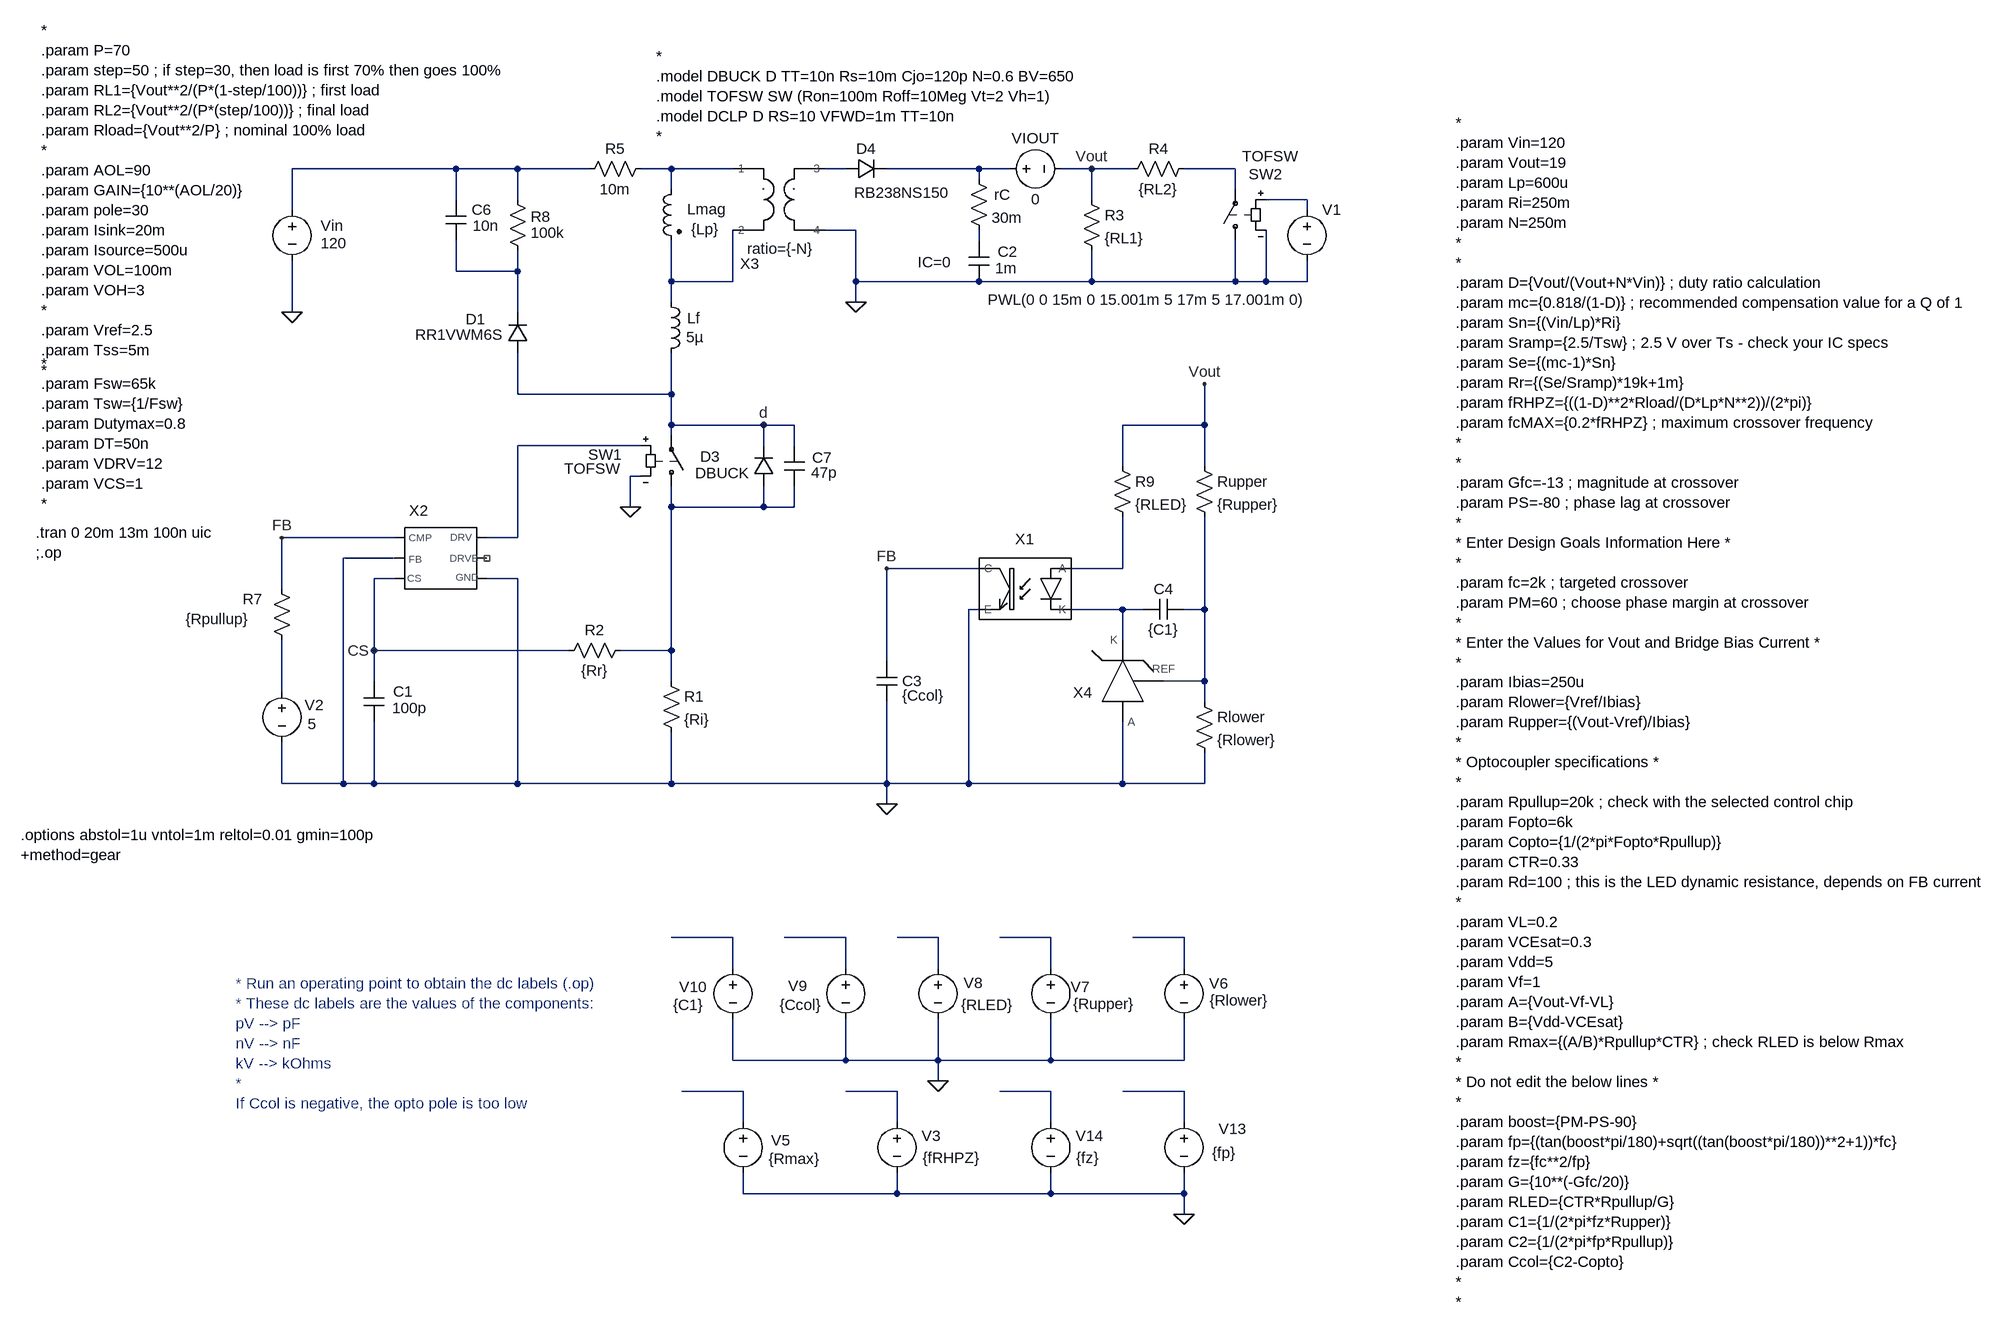
[diagram p0: schematic Flyback CM - isolated - cbc - load step.asc]
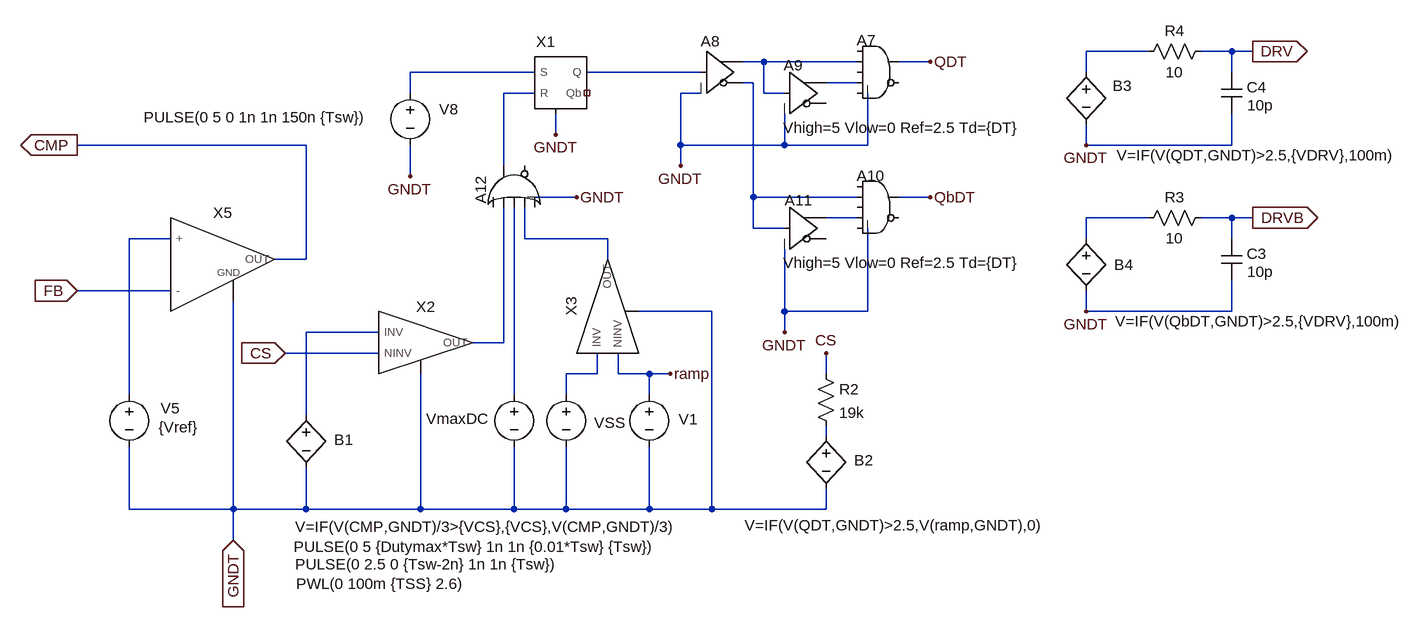
[diagram p1: sub-circuit generic_cm_pwm.asc]
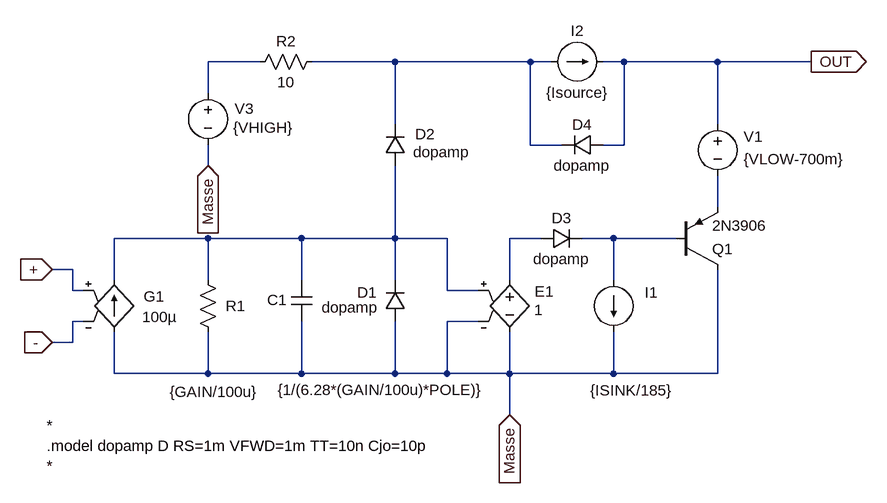
[diagram p2: sub-circuit op_amp_fan_out.asc]
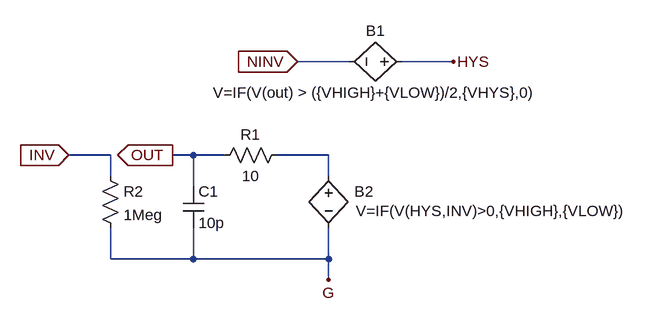
[diagram p3: sub-circuit comptof_g.asc]
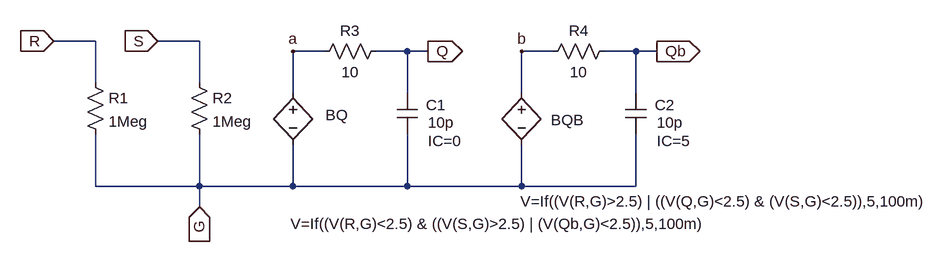
[diagram p4: sub-circuit sr_latch_g.asc]
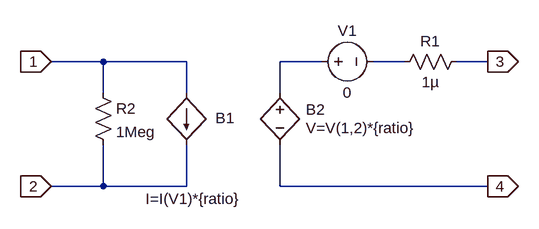
[diagram p5: sub-circuit xfmr.asc]
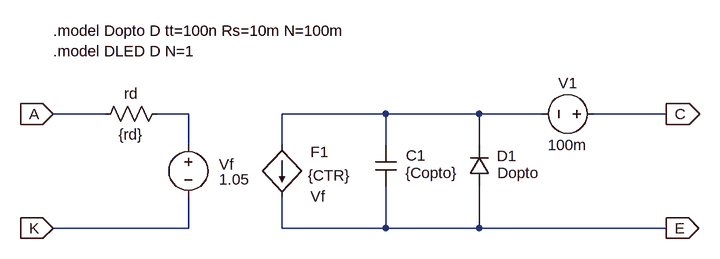
[diagram p6: sub-circuit optotof.asc]
Flyback CM - isolated - cbc - load step.asc, the LTspice schematic file:
Version 4.1
SHEET 1 3452 1760
WIRE -160 -224 -416 -224
WIRE -64 -224 -160 -224
WIRE 48 -224 -64 -224
WIRE 176 -224 128 -224
WIRE 272 -224 176 -224
WIRE 448 -224 416 -224
WIRE 656 -224 512 -224
WIRE 704 -224 656 -224
WIRE 832 -224 784 -224
WIRE 896 -224 832 -224
WIRE 1056 -224 976 -224
WIRE 656 -208 656 -224
WIRE 176 -192 176 -224
WIRE 1056 -192 1056 -224
WIRE -160 -176 -160 -224
WIRE -64 -176 -64 -224
WIRE 832 -176 832 -224
WIRE 1168 -176 1104 -176
WIRE -416 -160 -416 -224
WIRE 1168 -160 1168 -176
WIRE 464 -128 416 -128
WIRE 656 -112 656 -128
WIRE -160 -64 -160 -112
WIRE -64 -64 -64 -96
WIRE -64 -64 -160 -64
WIRE 176 -48 176 -112
WIRE 272 -48 272 -128
WIRE 272 -48 176 -48
WIRE 464 -48 464 -128
WIRE 656 -48 464 -48
WIRE 832 -48 832 -96
WIRE 832 -48 656 -48
WIRE 1056 -48 1056 -112
WIRE 1056 -48 832 -48
WIRE 1104 -48 1104 -128
WIRE 1104 -48 1056 -48
WIRE 1168 -48 1168 -80
WIRE 1168 -48 1104 -48
WIRE 176 -16 176 -48
WIRE 464 -16 464 -48
WIRE -416 0 -416 -80
WIRE -64 0 -64 -64
WIRE -64 128 -64 64
WIRE 176 128 176 64
WIRE 176 128 -64 128
WIRE 176 176 176 128
WIRE 320 176 176 176
WIRE 368 176 320 176
WIRE 1008 176 1008 112
WIRE 1008 176 880 176
WIRE 176 192 176 176
WIRE 128 208 -64 208
WIRE 320 208 320 176
WIRE 368 208 368 176
WIRE 880 240 880 176
WIRE 1008 240 1008 176
WIRE 128 256 112 256
WIRE 112 304 112 256
WIRE 176 304 176 272
WIRE 320 304 320 272
WIRE 320 304 176 304
WIRE 368 304 368 272
WIRE 368 304 320 304
WIRE -256 352 -432 352
WIRE -64 352 -64 208
WIRE -64 352 -112 352
WIRE -256 384 -336 384
WIRE 656 400 512 400
WIRE 880 400 880 320
WIRE 880 400 800 400
WIRE -256 416 -288 416
WIRE -64 416 -112 416
WIRE -432 432 -432 352
WIRE 656 464 640 464
WIRE 880 464 800 464
WIRE 912 464 880 464
WIRE 1008 464 1008 320
WIRE 1008 464 976 464
WIRE 880 512 880 464
WIRE -288 528 -288 416
WIRE 16 528 -288 528
WIRE 176 528 176 304
WIRE 176 528 96 528
WIRE 512 544 512 400
WIRE -288 576 -288 528
WIRE 176 576 176 528
WIRE 1008 576 1008 464
WIRE 1008 576 944 576
WIRE -432 592 -432 512
WIRE 1008 608 1008 576
WIRE -432 736 -432 672
WIRE -336 736 -336 384
WIRE -336 736 -432 736
WIRE -288 736 -288 640
WIRE -288 736 -336 736
WIRE -64 736 -64 416
WIRE -64 736 -288 736
WIRE 176 736 176 656
WIRE 176 736 -64 736
WIRE 512 736 512 608
WIRE 512 736 176 736
WIRE 640 736 640 464
WIRE 640 736 512 736
WIRE 880 736 880 640
WIRE 880 736 640 736
WIRE 1008 736 1008 688
WIRE 1008 736 880 736
WIRE 512 768 512 736
WIRE 272 976 176 976
WIRE 448 976 352 976
WIRE 592 976 528 976
WIRE 768 976 688 976
WIRE 976 976 896 976
WIRE 272 1024 272 976
WIRE 448 1024 448 976
WIRE 592 1024 592 976
WIRE 768 1024 768 976
WIRE 976 1024 976 976
WIRE 272 1168 272 1104
WIRE 448 1168 448 1104
WIRE 448 1168 272 1168
WIRE 592 1168 592 1104
WIRE 592 1168 448 1168
WIRE 768 1168 768 1104
WIRE 768 1168 592 1168
WIRE 976 1168 976 1104
WIRE 976 1168 768 1168
WIRE 592 1200 592 1168
WIRE 288 1216 192 1216
WIRE 528 1216 448 1216
WIRE 768 1216 688 1216
WIRE 976 1216 880 1216
WIRE 288 1264 288 1216
WIRE 528 1264 528 1216
WIRE 768 1264 768 1216
WIRE 976 1264 976 1216
WIRE 288 1376 288 1344
WIRE 528 1376 528 1344
WIRE 528 1376 288 1376
WIRE 768 1376 768 1344
WIRE 768 1376 528 1376
WIRE 976 1376 976 1344
WIRE 976 1376 768 1376
WIRE 976 1408 976 1376
FLAG 464 -16 0
FLAG -416 0 0
FLAG 832 -224 Vout
FLAG 512 768 0
FLAG 1008 112 Vout
FLAG 592 1200 0
FLAG 976 1408 0
FLAG 320 176 d
FLAG 512 400 FB
FLAG -432 352 FB
FLAG 112 304 0
FLAG -288 528 CS
DATAFLAG 192 976 ""
DATAFLAG 384 976 ""
DATAFLAG 560 976 ""
DATAFLAG 704 976 ""
DATAFLAG 928 976 ""
DATAFLAG 896 1216 ""
DATAFLAG 736 1216 ""
DATAFLAG 496 1216 ""
DATAFLAG 208 1216 ""
SYMBOL ind2 192 -208 M0
WINDOW 0 -69 47 Left 2
WINDOW 3 -58 78 Left 2
SYMATTR InstName Lmag
SYMATTR Value {Lp}
SYMATTR Type ind
SYMBOL sw 176 288 M180
WINDOW 3 -80 44 Right 2
WINDOW 0 -78 66 Right 2
SYMATTR Value TOFSW
SYMATTR InstName SW1
SYMBOL res 640 -224 R0
WINDOW 0 40 40 Left 2
SYMATTR InstName rC
SYMATTR Value 30m
SYMBOL cap 640 -112 R0
WINDOW 0 45 17 Left 2
WINDOW 3 41 43 Left 2
WINDOW 123 -80 34 Left 2
SYMATTR InstName C2
SYMATTR Value 1m
SYMATTR Value2 IC=0
SYMBOL res 816 -192 R0
SYMATTR InstName R3
SYMATTR Value {RL1}
SYMBOL voltage -416 -176 R0
WINDOW 0 45 41 Left 2
WINDOW 3 45 68 Left 2
SYMATTR InstName Vin
SYMATTR Value 120
SYMBOL res 992 592 R0
SYMATTR InstName Rlower
SYMATTR Value {Rlower}
SYMBOL res 992 224 R0
SYMATTR InstName Rupper
SYMATTR Value {Rupper}
SYMBOL voltage 976 1008 R0
WINDOW 0 39 40 Left 2
WINDOW 3 40 66 Left 2
WINDOW 123 0 0 Left 0
WINDOW 39 0 0 Left 0
SYMATTR InstName V6
SYMATTR Value {Rlower}
SYMBOL voltage 768 1008 R0
WINDOW 0 31 45 Left 2
WINDOW 3 35 72 Left 2
WINDOW 123 0 0 Left 0
WINDOW 39 0 0 Left 0
SYMATTR InstName V7
SYMATTR Value {Rupper}
SYMBOL voltage 592 1008 R0
WINDOW 0 40 39 Left 2
WINDOW 3 36 73 Left 2
WINDOW 123 0 0 Left 0
WINDOW 39 0 0 Left 0
SYMATTR InstName V8
SYMATTR Value {RLED}
SYMBOL voltage 448 1008 R0
WINDOW 0 -90 44 Left 2
WINDOW 3 -103 73 Left 2
SYMATTR InstName V9
SYMATTR Value {Ccol}
SYMBOL voltage 272 1008 R0
WINDOW 0 -84 45 Left 2
WINDOW 3 -93 73 Left 2
WINDOW 123 0 0 Left 0
WINDOW 39 0 0 Left 0
SYMATTR InstName V10
SYMATTR Value {C1}
SYMBOL voltage 976 1248 R0
WINDOW 0 54 27 Left 2
WINDOW 3 44 64 Left 2
WINDOW 123 0 0 Left 0
WINDOW 39 0 0 Left 0
SYMATTR InstName V13
SYMATTR Value {fp}
SYMBOL voltage 768 1248 R0
WINDOW 0 39 38 Left 2
WINDOW 3 40 72 Left 2
SYMATTR InstName V14
SYMATTR Value {fz}
SYMBOL res 144 -240 R90
WINDOW 0 0 56 VBottom 2
WINDOW 3 32 56 VTop 2
SYMATTR InstName R5
SYMATTR Value 10m
SYMBOL voltage 528 1248 R0
WINDOW 0 39 38 Left 2
WINDOW 3 40 72 Left 2
SYMATTR InstName V3
SYMATTR Value {fRHPZ}
SYMBOL ind 160 -32 R0
WINDOW 0 41 41 Left 2
WINDOW 3 39 71 Left 2
SYMATTR InstName Lf
SYMATTR Value 5µ
SYMBOL diode -48 64 R180
WINDOW 0 66 53 Left 2
WINDOW 3 40 29 Left 2
SYMATTR InstName D1
SYMATTR Value RR1VWM6S
SYMBOL res -80 -192 R0
WINDOW 0 36 43 Left 2
WINDOW 3 36 68 Left 2
SYMATTR InstName R8
SYMATTR Value 100k
SYMBOL cap -176 -176 R0
WINDOW 0 40 16 Left 2
WINDOW 3 42 41 Left 2
SYMATTR InstName C6
SYMATTR Value 10n
SYMBOL diode 336 272 R180
WINDOW 0 84 47 Left 2
WINDOW 3 40 21 Left 2
SYMATTR InstName D3
SYMATTR Value DBUCK
SYMBOL cap 352 208 R0
WINDOW 0 44 19 Left 2
WINDOW 3 42 42 Left 2
SYMATTR InstName C7
SYMATTR Value 47p
SYMBOL voltage -432 576 R0
WINDOW 0 36 37 Left 2
WINDOW 3 40 67 Left 2
SYMATTR InstName V2
SYMATTR Value 5
SYMBOL res -448 416 R0
WINDOW 3 -134 63 Left 2
WINDOW 0 -45 32 Left 2
SYMATTR Value {Rpullup}
SYMATTR InstName R7
SYMBOL cap 496 544 R0
WINDOW 0 40 32 Left 2
WINDOW 3 40 54 Left 2
SYMATTR InstName C3
SYMATTR Value {Ccol}
SYMBOL res 864 224 R0
SYMATTR InstName R9
SYMATTR Value {RLED}
SYMBOL cap 976 448 R90
WINDOW 0 0 32 VBottom 2
WINDOW 3 32 32 VTop 2
SYMATTR InstName C4
SYMATTR Value {C1}
SYMBOL voltage 288 1248 R0
WINDOW 0 44 45 Left 2
WINDOW 3 40 74 Left 2
WINDOW 123 0 0 Left 0
WINDOW 39 0 0 Left 0
SYMATTR InstName V5
SYMATTR Value {Rmax}
SYMBOL diode 448 -208 R270
WINDOW 0 32 32 VTop 2
WINDOW 3 -6 87 VBottom 2
SYMATTR InstName D4
SYMATTR Value RB238NS150
SYMBOL res 160 560 R0
SYMATTR InstName R1
SYMATTR Value {Ri}
SYMBOL res 112 512 R90
WINDOW 0 0 56 VBottom 2
WINDOW 3 32 56 VTop 2
SYMATTR InstName R2
SYMATTR Value {Rr}
SYMBOL cap -304 576 R0
WINDOW 0 46 16 Left 2
WINDOW 3 44 42 Left 2
SYMATTR InstName C1
SYMATTR Value 100p
SYMBOL res 992 -240 R90
WINDOW 0 0 56 VBottom 2
WINDOW 3 32 56 VTop 2
SYMATTR InstName R4
SYMATTR Value {RL2}
SYMBOL sw 1056 -96 R180
WINDOW 3 -98 148 Left 2
WINDOW 0 -73 120 Left 2
SYMATTR Value TOFSW
SYMATTR InstName SW2
SYMBOL voltage 1168 -176 R0
WINDOW 3 -498 156 Left 2
WINDOW 123 0 0 Left 0
WINDOW 39 0 0 Left 0
SYMATTR Value PWL(0 0 15m 0 15.001m 5 17m 5 17.001m 0)
SYMATTR InstName V1
SYMBOL voltage 688 -224 R270
WINDOW 0 32 56 VTop 2
WINDOW 3 -32 56 VBottom 2
SYMATTR InstName VIOUT
SYMATTR Value 0
SYMBOL TOF\\Subcircuits\\Generic_CM_PWM -192 352 R0
WINDOW 0 -27 -27 Bottom 2
SYMATTR InstName X2
SYMATTR SpiceLine gain={gain} pole={pole} Isink={Isink} Isource={Isource} Vlow={VOL} Vhigh={VOH}
SYMBOL TOF\\Subcircuits\\XFMR 304 -208 R0
WINDOW 0 -6 148 Bottom 2
WINDOW 39 42 124 Bottom 2
SYMATTR InstName X3
SYMATTR SpiceLine ratio={-N}
SYMBOL TOF\\Subcircuits\\optoTOF 688 432 M0
SYMATTR InstName X1
SYMATTR SpiceLine Copto={Copto} Rd={Rd} CTR={CTR}
SYMBOL TOF\\Subcircuits\\TL431TOF 864 528 R0
WINDOW 0 -46 81 Bottom 2
SYMATTR InstName X4
TEXT 152 -400 Left 2 !*\n.model DBUCK D TT=10n Rs=10m Cjo=120p N=0.6 BV=650\n.model TOFSW SW (Ron=100m Roff=10Meg Vt=2 Vh=1)\n.model DCLP D RS=10 VFWD=1m TT=10n\n*
TEXT -816 344 Left 2 !.tran 0 20m 13m 100n uic\n;.op
TEXT -840 816 Left 2 !.options abstol=1u vntol=1m reltol=0.01 gmin=100p\n+method=gear
TEXT -504 1048 Left 2 ;* Run an operating point to obtain the dc labels (.op)\n* These dc labels are the values of the components:\npV --> pF\nnV --> nF\nkV --> kOhms\n*\nIf Ccol is negative, the opto pole is too low
TEXT 1400 -296 Left 2 !*\n.param Vin=120\n.param Vout=19\n.param Lp=600u\n.param Ri=250m\n.param N=250m\n*\n*\n.param D={Vout/(Vout+N*Vin)} ; duty ratio calculation\n.param mc={0.818/(1-D)} ; recommended compensation value for a Q of 1\n.param Sn={(Vin/Lp)*Ri}\n.param Sramp={2.5/Tsw} ; 2.5 V over Ts - check your IC specs\n.param Se={(mc-1)*Sn}\n.param Rr={(Se/Sramp)*19k+1m}\n.param fRHPZ={((1-D)**2*Rload/(D*Lp*N**2))/(2*pi)}\n.param fcMAX={0.2*fRHPZ} ; maximum crossover frequency\n*\n*\n.param Gfc=-13 ; magnitude at crossover\n.param PS=-80 ; phase lag at crossover\n*\n* Enter Design Goals Information Here *\n*\n.param fc=2k ; targeted crossover\n.param PM=60 ; choose phase margin at crossover\n*\n* Enter the Values for Vout and Bridge Bias Current *\n*\n.param Ibias=250u\n.param Rlower={Vref/Ibias}\n.param Rupper={(Vout-Vref)/Ibias}\n*\n* Optocoupler specifications *\n*\n.param Rpullup=20k ; check with the selected control chip\n.param Fopto=6k\n.param Copto={1/(2*pi*Fopto*Rpullup)}\n.param CTR=0.33\n.param Rd=100 ; this is the LED dynamic resistance, depends on FB current\n*\n.param VL=0.2\n.param VCEsat=0.3\n.param Vdd=5\n.param Vf=1\n.param A={Vout-Vf-VL}\n.param B={Vdd-VCEsat}\n.param Rmax={(A/B)*Rpullup*CTR} ; check RLED is below Rmax\n*\n* Do not edit the below lines *\n*\n.param boost={PM-PS-90}\n.param fp={(tan(boost*pi/180)+sqrt((tan(boost*pi/180))**2+1))*fc}\n.param fz={fc**2/fp}\n.param G={10**(-Gfc/20)}\n.param RLED={CTR*Rpullup/G}\n.param C1={1/(2*pi*fz*Rupper)}\n.param C2={1/(2*pi*fp*Rpullup)}\n.param Ccol={C2-Copto}\n*\n*
TEXT -808 -440 Left 2 !*\n.param P=70\n.param step=50 ; if step=30, then load is first 70% then goes 100%\n.param RL1={Vout**2/(P*(1-step/100))} ; first load\n.param RL2={Vout**2/(P*(step/100))} ; final load\n.param Rload={Vout**2/P} ; nominal 100% load\n*\n.param AOL=90\n.param GAIN={10**(AOL/20)}\n.param pole=30\n.param Isink=20m\n.param Isource=500u\n.param VOL=100m\n.param VOH=3\n*\n.param Vref=2.5\n.param Tss=5m\n*
TEXT -808 80 Left 2 !*\n.param Fsw=65k\n.param Tsw={1/Fsw}\n.param Dutymax=0.8\n.param DT=50n\n.param VDRV=12\n.param VCS=1\n*

generic_cm_pwm.asc, the sub-circuit schematic file:
Version 4.1
SHEET 1 1744 1720
WIRE 448 816 352 816
WIRE 576 816 528 816
WIRE 608 816 576 816
WIRE -144 832 -176 832
WIRE 0 832 -144 832
WIRE 112 832 64 832
WIRE -496 848 -688 848
WIRE -240 848 -416 848
WIRE 352 848 352 816
WIRE 576 848 576 816
WIRE -160 864 -176 864
WIRE 0 864 -48 864
WIRE -688 880 -688 848
WIRE -496 880 -544 880
WIRE -240 880 -272 880
WIRE -144 880 -144 832
WIRE -112 880 -144 880
WIRE -464 944 -464 912
WIRE -848 960 -1200 960
WIRE -272 960 -272 880
WIRE -112 960 -112 912
WIRE -112 960 -272 960
WIRE 16 960 16 880
WIRE 16 960 -112 960
WIRE 352 960 352 928
WIRE 576 960 576 912
WIRE 576 960 352 960
WIRE -544 992 -544 880
WIRE -272 992 -272 960
WIRE -688 1008 -688 960
WIRE -432 1040 -496 1040
WIRE -160 1040 -160 864
WIRE 0 1040 -160 1040
WIRE 112 1040 64 1040
WIRE 0 1072 -48 1072
WIRE 448 1072 352 1072
WIRE 576 1072 528 1072
WIRE 608 1072 576 1072
WIRE -160 1088 -160 1040
WIRE -112 1088 -160 1088
WIRE -1056 1104 -1120 1104
WIRE -512 1104 -512 1056
WIRE -384 1104 -512 1104
WIRE 352 1104 352 1072
WIRE 576 1104 576 1072
WIRE -848 1136 -848 960
WIRE -848 1136 -896 1136
WIRE -384 1136 -384 1104
WIRE -1056 1184 -1200 1184
WIRE -224 1216 -336 1216
WIRE -112 1216 -112 1120
WIRE 16 1216 16 1088
WIRE 16 1216 -112 1216
WIRE 352 1216 352 1184
WIRE 576 1216 576 1168
WIRE 576 1216 352 1216
WIRE -736 1248 -848 1248
WIRE -112 1248 -112 1216
WIRE -544 1264 -544 1056
WIRE -544 1264 -592 1264
WIRE -736 1280 -880 1280
WIRE -400 1312 -400 1280
WIRE -400 1312 -448 1312
WIRE -368 1312 -368 1280
WIRE -320 1312 -368 1312
WIRE -288 1312 -320 1312
WIRE -48 1312 -48 1280
WIRE -1120 1344 -1120 1104
WIRE -528 1344 -528 1056
WIRE -448 1344 -448 1312
WIRE -320 1344 -320 1312
WIRE -848 1376 -848 1248
WIRE -48 1408 -48 1392
WIRE -1120 1520 -1120 1424
WIRE -960 1520 -960 1200
WIRE -960 1520 -1120 1520
WIRE -848 1520 -848 1456
WIRE -848 1520 -960 1520
WIRE -672 1520 -672 1312
WIRE -672 1520 -848 1520
WIRE -528 1520 -528 1424
WIRE -528 1520 -672 1520
WIRE -448 1520 -448 1424
WIRE -448 1520 -528 1520
WIRE -320 1520 -320 1424
WIRE -320 1520 -448 1520
WIRE -224 1520 -224 1216
WIRE -224 1520 -320 1520
WIRE -48 1520 -48 1488
WIRE -48 1520 -224 1520
WIRE -960 1568 -960 1520
FLAG 112 832 QDT
FLAG 112 1040 QbDT
FLAG 352 1216 GNDT
FLAG 352 960 GNDT
FLAG 608 1072 DRVB
IOPIN 608 1072 Out
FLAG 608 816 DRV
IOPIN 608 816 Out
FLAG -1200 960 CMP
IOPIN -1200 960 Out
FLAG -1200 1184 FB
IOPIN -1200 1184 In
FLAG -880 1280 CS
IOPIN -880 1280 In
FLAG -960 1568 GNDT
IOPIN -960 1568 In
FLAG -688 1008 GNDT
FLAG -112 1248 GNDT
FLAG -272 992 GNDT
FLAG -464 944 GNDT
FLAG -432 1040 GNDT
FLAG -288 1312 ramp
FLAG -48 1280 CS
SYMBOL Digital\\and 32 784 R0
WINDOW 0 -33 15 Left 2
SYMATTR InstName A7
SYMATTR SpiceLine Vhigh=5 Vlow=0 Ref=2.5
SYMBOL Digital\\buf -240 784 R0
WINDOW 0 -1 16 Left 2
SYMATTR InstName A8
SYMATTR SpiceLine Vhigh=5 Vlow=0 Ref=1.0
SYMBOL Digital\\buf -112 816 R0
WINDOW 0 -1 21 Left 2
WINDOW 39 -2 117 Left 2
SYMATTR InstName A9
SYMATTR SpiceLine Vhigh=5 Vlow=0 Ref=2.5 Td={DT}
SYMBOL Digital\\and 32 992 R0
WINDOW 0 -33 15 Left 2
SYMATTR InstName A10
SYMATTR SpiceLine Vhigh=5 Vlow=0 Ref=2.5
SYMBOL Digital\\buf -112 1024 R0
WINDOW 0 0 21 Left 2
WINDOW 39 -2 117 Left 2
SYMATTR InstName A11
SYMATTR SpiceLine Vhigh=5 Vlow=0 Ref=2.5 Td={DT}
SYMBOL bv 352 832 R0
WINDOW 0 41 37 Left 2
WINDOW 3 47 144 Left 2
SYMATTR InstName B3
SYMATTR Value V=IF(V(QDT,GNDT)>2.5,{VDRV},100m)
SYMBOL bv 352 1088 R0
WINDOW 0 43 56 Left 2
WINDOW 3 45 143 Left 2
SYMATTR InstName B4
SYMATTR Value V=IF(V(QbDT,GNDT)>2.5,{VDRV},100m)
SYMBOL res 544 1056 R90
WINDOW 0 0 56 VBottom 2
WINDOW 3 32 56 VTop 2
SYMATTR InstName R3
SYMATTR Value 10
SYMBOL cap 560 1104 R0
WINDOW 0 39 23 Left 2
WINDOW 3 40 51 Left 2
SYMATTR InstName C3
SYMATTR Value 10p
SYMBOL res 544 800 R90
WINDOW 0 0 56 VBottom 2
WINDOW 3 32 56 VTop 2
SYMATTR InstName R4
SYMATTR Value 10
SYMBOL cap 560 848 R0
WINDOW 0 39 23 Left 2
WINDOW 3 40 51 Left 2
SYMATTR InstName C4
SYMATTR Value 10p
SYMBOL op_amp_fan_out -976 1136 R0
SYMATTR InstName X5
SYMATTR SpiceLine gain={gain} pole={pole} Isink={Isink} Isource={Isource} Vlow={VOL} Vhigh={VOH}
SYMBOL Digital\\or -592 1024 R270
WINDOW 0 -27 13 Left 2
SYMATTR InstName A12
SYMATTR SpiceLine Vhigh=5 Vlow=0 Ref=2.5
SYMBOL voltage -1120 1328 R0
WINDOW 0 48 37 Left 2
WINDOW 3 45 66 Left 2
SYMATTR InstName V5
SYMATTR Value {Vref}
SYMBOL voltage -688 864 R0
WINDOW 0 45 41 Left 2
WINDOW 3 -410 53 Left 2
WINDOW 123 0 0 Left 0
WINDOW 39 0 0 Left 0
SYMATTR InstName V8
SYMATTR Value PULSE(0 5 0 1n 1n 150n {Tsw})
SYMBOL voltage -528 1328 R0
WINDOW 0 -135 53 Left 2
WINDOW 3 -339 250 Left 2
WINDOW 123 0 0 Left 0
WINDOW 39 0 0 Left 0
SYMATTR InstName VmaxDC
SYMATTR Value PULSE(0 5 {Dutymax*Tsw} 1n 1n {0.01*Tsw} {Tsw})
SYMBOL bv -848 1360 R0
WINDOW 0 43 53 Left 2
WINDOW 3 -17 187 Left 2
SYMATTR InstName B1
SYMATTR Value V=IF(V(CMP,GNDT)/3>{VCS},{VCS},V(CMP,GNDT)/3)
SYMBOL voltage -320 1328 R0
WINDOW 0 45 54 Left 2
WINDOW 3 -545 277 Left 2
WINDOW 123 0 0 Left 0
WINDOW 39 0 0 Left 0
SYMATTR InstName V1
SYMATTR Value PULSE(0 2.5 0 {Tsw-2n} 1n 1n {Tsw})
SYMBOL voltage -448 1328 R0
WINDOW 0 43 59 Left 2
WINDOW 3 -415 307 Left 2
WINDOW 123 0 0 Left 0
WINDOW 39 0 0 Left 0
SYMATTR InstName VSS
SYMATTR Value PWL(0 100m {TSS} 2.6)
SYMBOL res -64 1296 R0
SYMATTR InstName R2
SYMATTR Value 19k
SYMBOL bv -48 1392 R0
WINDOW 0 43 53 Left 2
WINDOW 3 -125 153 Left 2
SYMATTR InstName B2
SYMATTR Value V=IF(V(QDT,GNDT)>2.5,V(ramp,GNDT),0)
SYMBOL TOF\\Subcircuits\\COMPTOF_G -672 1264 R0
SYMATTR InstName X2
SYMATTR SpiceLine VHIGH=5 VLOW=100m VHYS=10m
SYMBOL TOF\\Subcircuits\\COMPTOF_G -384 1216 R270
SYMATTR InstName X3
SYMATTR SpiceLine VHIGH=5 VLOW=100m VHYS=10m
SYMBOL TOF\\Subcircuits\\SR_latch_G -464 864 R0
WINDOW 0 -15 -47 Bottom 2
SYMATTR InstName X1

op_amp_fan_out.asc, the sub-circuit schematic file:
Version 4.1
SHEET 1 1504 680
WIRE 96 -224 16 -224
WIRE 304 -224 176 -224
WIRE 512 -224 304 -224
WIRE 544 -224 512 -224
WIRE 656 -224 624 -224
WIRE 800 -224 656 -224
WIRE 944 -224 800 -224
WIRE 16 -176 16 -224
WIRE 304 -128 304 -224
WIRE 800 -128 800 -224
WIRE 512 -96 512 -224
WIRE 560 -96 512 -96
WIRE 656 -96 656 -224
WIRE 656 -96 624 -96
WIRE 16 -64 16 -96
WIRE 800 0 800 -48
WIRE 16 48 -128 48
WIRE 160 48 16 48
WIRE 304 48 304 -64
WIRE 304 48 160 48
WIRE 384 48 304 48
WIRE 528 48 480 48
WIRE 640 48 592 48
WIRE 736 48 640 48
WIRE -192 96 -224 96
WIRE -128 112 -128 48
WIRE 16 112 16 48
WIRE 160 112 160 48
WIRE 304 112 304 48
WIRE 480 112 480 48
WIRE 640 112 640 48
WIRE -192 128 -192 96
WIRE -176 128 -192 128
WIRE 384 128 384 48
WIRE 432 128 384 128
WIRE -176 176 -192 176
WIRE 432 176 384 176
WIRE -192 208 -192 176
WIRE -192 208 -224 208
WIRE -128 256 -128 192
WIRE 16 256 16 192
WIRE 16 256 -128 256
WIRE 160 256 160 176
WIRE 160 256 16 256
WIRE 304 256 304 176
WIRE 304 256 160 256
WIRE 384 256 384 176
WIRE 384 256 304 256
WIRE 480 256 480 192
WIRE 480 256 384 256
WIRE 640 256 640 192
WIRE 640 256 480 256
WIRE 800 256 800 96
WIRE 800 256 640 256
WIRE 480 320 480 256
FLAG -224 96 +
IOPIN -224 96 In
FLAG -224 208 -
IOPIN -224 208 In
FLAG 944 -224 OUT
IOPIN 944 -224 Out
FLAG 480 320 Masse
IOPIN 480 320 In
FLAG 16 -64 Masse
IOPIN 16 -64 In
DATAFLAG 800 -16 ""
SYMBOL g -128 96 R0
WINDOW 0 45 41 Left 2
WINDOW 3 43 73 Left 2
SYMATTR InstName G1
SYMATTR Value 100µ
SYMBOL res 0 96 R0
WINDOW 0 43 56 Left 2
WINDOW 3 -43 188 Left 2
SYMATTR InstName R1
SYMATTR Value {GAIN/100u}
SYMBOL cap 144 112 R0
WINDOW 0 -37 31 Left 2
WINDOW 3 -21 169 Left 2
SYMATTR InstName C1
SYMATTR Value {1/(6.28*(GAIN/100u)*POLE)}
SYMBOL diode 320 176 R180
WINDOW 0 44 45 Left 2
WINDOW 3 41 22 Left 2
SYMATTR InstName D1
SYMATTR Value dopamp
SYMBOL e 480 96 R0
WINDOW 0 39 34 Left 2
WINDOW 3 38 62 Left 2
SYMATTR InstName E1
SYMATTR Value 1
SYMBOL diode 528 64 R270
WINDOW 0 32 32 VTop 2
WINDOW 3 0 32 VBottom 2
SYMATTR InstName D3
SYMATTR Value dopamp
SYMBOL current 640 112 R0
WINDOW 0 48 19 Left 2
WINDOW 3 -36 170 Left 2
SYMATTR InstName I1
SYMATTR Value {ISINK/185}
SYMBOL pnp 736 96 M180
SYMATTR InstName Q1
SYMATTR Value 2N3906
SYMBOL voltage 800 -144 R0
WINDOW 0 40 35 Left 2
WINDOW 3 40 70 Left 2
SYMATTR InstName V1
SYMATTR Value {VLOW-700m}
SYMBOL current 544 -224 R270
WINDOW 0 32 40 VTop 2
WINDOW 3 -32 40 VBottom 2
SYMATTR InstName I2
SYMATTR Value {Isource}
SYMBOL diode 624 -80 M270
WINDOW 0 32 32 VTop 2
WINDOW 3 0 32 VBottom 2
SYMATTR InstName D4
SYMATTR Value dopamp
SYMBOL voltage 16 -192 R0
WINDOW 0 41 40 Left 2
WINDOW 3 39 69 Left 2
SYMATTR InstName V3
SYMATTR Value {VHIGH}
SYMBOL diode 288 -64 M180
WINDOW 0 47 49 Left 2
WINDOW 3 44 21 Left 2
SYMATTR InstName D2
SYMATTR Value dopamp
SYMBOL res 192 -240 R90
WINDOW 0 0 56 VBottom 2
WINDOW 3 32 56 VTop 2
SYMATTR InstName R2
SYMATTR Value 10
TEXT -232 336 Left 2 !*\n.model dopamp D RS=1m VFWD=1m TT=10n Cjo=10p\n*

comptof_g.asc, the sub-circuit schematic file:
Version 4.1
SHEET 1 880 680
WIRE 64 192 -16 192
WIRE 224 192 144 192
WIRE -304 336 -368 336
WIRE -176 336 -208 336
WIRE -128 336 -176 336
WIRE 32 336 -48 336
WIRE -304 368 -304 336
WIRE 32 368 32 336
WIRE -176 384 -176 336
WIRE -304 496 -304 448
WIRE -176 496 -176 448
WIRE -176 496 -304 496
WIRE 32 496 32 448
WIRE 32 496 -176 496
WIRE 32 528 32 496
FLAG -16 192 NINV
IOPIN -16 192 In
FLAG 224 192 HYS
FLAG -208 336 OUT
IOPIN -208 336 Out
FLAG -368 336 INV
IOPIN -368 336 In
FLAG 32 528 G
SYMBOL bv 160 192 R90
WINDOW 0 -32 56 VBottom 2
WINDOW 3 32 56 VTop 2
SYMATTR InstName B1
SYMATTR Value V=IF(V(out) > ({VHIGH}+{VLOW})/2,{VHYS},0)
SYMBOL bv 32 352 R0
WINDOW 0 40 40 Left 2
WINDOW 3 42 70 Left 2
SYMATTR InstName B2
SYMATTR Value V=IF(V(HYS,INV)>0,{VHIGH},{VLOW})
SYMBOL res -32 320 R90
WINDOW 0 0 56 VBottom 2
WINDOW 3 32 56 VTop 2
SYMATTR InstName R1
SYMATTR Value 10
SYMBOL cap -192 384 R0
SYMATTR InstName C1
SYMATTR Value 10p
SYMBOL res -320 352 R0
SYMATTR InstName R2
SYMATTR Value 1Meg

sr_latch_g.asc, the sub-circuit schematic file:
Version 4.1
SHEET 1 1168 680
WIRE -192 48 -256 48
WIRE -32 48 -96 48
WIRE 160 64 112 64
WIRE 288 64 240 64
WIRE 320 64 288 64
WIRE 512 64 464 64
WIRE 640 64 592 64
WIRE 672 64 640 64
WIRE -192 112 -192 48
WIRE -32 112 -32 48
WIRE 112 128 112 64
WIRE 288 128 288 64
WIRE 464 128 464 64
WIRE 640 128 640 64
WIRE -192 272 -192 192
WIRE -32 272 -32 192
WIRE -32 272 -192 272
WIRE 112 272 112 208
WIRE 112 272 -32 272
WIRE 288 272 288 192
WIRE 288 272 112 272
WIRE 464 272 464 208
WIRE 464 272 288 272
WIRE 640 272 640 192
WIRE 640 272 464 272
WIRE -32 304 -32 272
FLAG -256 48 R
IOPIN -256 48 In
FLAG -96 48 S
IOPIN -96 48 In
FLAG 320 64 Q
IOPIN 320 64 Out
FLAG 672 64 Qb
IOPIN 672 64 Out
FLAG 112 64 a
FLAG 464 64 b
FLAG -32 304 G
IOPIN -32 304 In
SYMBOL bv 112 112 R0
WINDOW 0 50 50 Left 2
WINDOW 3 -4 218 Left 2
SYMATTR InstName BQ
SYMATTR Value V=If((V(R,G)<2.5) & ((V(S,G)>2.5) | (V(Qb,G)<2.5)),5,100m)
SYMBOL res -208 96 R0
SYMATTR InstName R1
SYMATTR Value 1Meg
SYMBOL res -48 96 R0
SYMATTR InstName R2
SYMATTR Value 1Meg
SYMBOL res 256 48 R90
WINDOW 0 0 56 VBottom 2
WINDOW 3 32 56 VTop 2
SYMATTR InstName R3
SYMATTR Value 10
SYMBOL cap 272 128 R0
WINDOW 0 45 19 Left 2
WINDOW 3 48 46 Left 2
WINDOW 123 48 74 Left 2
SYMATTR InstName C1
SYMATTR Value 10p
SYMATTR Value2 IC=0
SYMBOL bv 464 112 R0
WINDOW 0 45 58 Left 2
WINDOW 3 -2 183 Left 2
SYMATTR InstName BQB
SYMATTR Value V=If((V(R,G)>2.5) | ((V(Q,G)<2.5) & (V(S,G)<2.5)),5,100m)
SYMBOL res 608 48 R90
WINDOW 0 0 56 VBottom 2
WINDOW 3 32 56 VTop 2
SYMATTR InstName R4
SYMATTR Value 10
SYMBOL cap 624 128 R0
WINDOW 0 45 19 Left 2
WINDOW 3 48 46 Left 2
WINDOW 123 48 74 Left 2
SYMATTR InstName C2
SYMATTR Value 10p
SYMATTR Value2 IC=5

xfmr.asc, the sub-circuit schematic file:
Version 4.1
SHEET 1 880 680
WIRE 32 96 -48 96
WIRE 160 96 32 96
WIRE 368 96 304 96
WIRE 496 96 448 96
WIRE 624 96 576 96
WIRE 32 144 32 96
WIRE 160 144 160 96
WIRE 304 144 304 96
WIRE 32 288 32 224
WIRE 32 288 -48 288
WIRE 160 288 160 224
WIRE 160 288 32 288
WIRE 304 288 304 224
WIRE 624 288 304 288
FLAG 624 288 4
IOPIN 624 288 Out
FLAG 624 96 3
IOPIN 624 96 Out
FLAG -48 96 1
IOPIN -48 96 In
FLAG -48 288 2
IOPIN -48 288 In
SYMBOL bi 160 144 R0
WINDOW 0 45 39 Left 2
WINDOW 3 -63 163 Left 2
SYMATTR InstName B1
SYMATTR Value I=I(V1)*{ratio}
SYMBOL bv 304 128 R0
WINDOW 0 40 42 Left 2
WINDOW 3 40 70 Left 2
SYMATTR InstName B2
SYMATTR Value V=V(1,2)*{ratio}
SYMBOL voltage 352 96 R270
WINDOW 0 32 56 VTop 2
WINDOW 3 -32 56 VBottom 2
WINDOW 123 0 0 Left 0
WINDOW 39 0 0 Left 0
SYMATTR InstName V1
SYMATTR Value 0
SYMBOL res 592 80 R90
WINDOW 0 0 56 VBottom 2
WINDOW 3 32 56 VTop 2
SYMATTR InstName R1
SYMATTR Value 1µ
SYMBOL res 16 128 R0
SYMATTR InstName R2
SYMATTR Value 1Meg

optotof.asc, the sub-circuit schematic file:
Version 4
SHEET 1 892 680
WIRE -48 32 -128 32
WIRE 80 32 32 32
WIRE 384 32 224 32
WIRE 528 32 384 32
WIRE 624 32 528 32
WIRE 816 32 704 32
WIRE 80 80 80 32
WIRE 224 80 224 32
WIRE 384 80 384 32
WIRE 528 80 528 32
WIRE 80 208 80 160
WIRE 80 208 -128 208
WIRE 224 208 224 160
WIRE 384 208 384 144
WIRE 384 208 224 208
WIRE 528 208 528 144
WIRE 528 208 384 208
WIRE 816 208 528 208
FLAG -128 32 A
IOPIN -128 32 In
FLAG -128 208 K
IOPIN -128 208 In
FLAG 816 32 C
IOPIN 816 32 Out
FLAG 816 208 E
IOPIN 816 208 Out
SYMBOL f 224 80 R0
WINDOW 0 44 11 Left 2
WINDOW 3 40 47 Left 2
WINDOW 38 44 79 Left 2
SYMATTR InstName F1
SYMATTR Value {CTR}
SYMATTR SpiceModel Vf
SYMBOL res 48 16 R90
WINDOW 0 0 56 VBottom 2
WINDOW 3 32 56 VTop 2
SYMATTR InstName rd
SYMATTR Value {rd}
SYMBOL voltage 80 64 R0
WINDOW 0 47 46 Left 2
WINDOW 3 47 69 Left 2
WINDOW 123 0 0 Left 0
WINDOW 39 0 0 Left 0
SYMATTR InstName Vf
SYMATTR Value 1.05
SYMBOL voltage 720 32 R90
WINDOW 0 -32 56 VBottom 2
WINDOW 3 32 56 VTop 2
SYMATTR InstName V1
SYMATTR Value 100m
SYMBOL cap 368 80 R0
WINDOW 0 47 16 Left 2
WINDOW 3 46 43 Left 2
SYMATTR InstName C1
SYMATTR Value {Copto}
SYMBOL diode 512 144 M180
WINDOW 0 43 47 Left 2
WINDOW 3 44 21 Left 2
SYMATTR InstName D1
SYMATTR Value Dopto
TEXT -128 -96 Left 2 !.model Dopto D tt=100n Rs=10m N=100m\n.model DLED D N=1

The netlist it stands for:
* Flyback CM - isolated - cbc - load step.asc
Lmag N002 N009 {Lp}
SW1 N011 d N010 0 TOFSW
rC N004 N007 30m
C2 N007 0 1m IC=0
R3 Vout 0 {RL1}
Vin N001 0 120
Rlower N014 0 {Rlower}
Rupper Vout N014 {Rupper}
V6 N020 0 {Rlower}
V7 N019 0 {Rupper}
V8 N018 0 {RLED}
V9 N017 0 {Ccol}
V10 N016 0 {C1}
V13 N024 0 {fp}
V14 N023 0 {fz}
R5 N002 N001 10m
V3 N022 0 {fRHPZ}
Lf N009 d 5µ
D1 d N008 RR1VWM6S
R8 N001 N008 100k
C6 N001 N008 10n
D3 N011 d DBUCK
C7 d N011 47p
V2 N015 0 5
R7 FB N015 {Rpullup}
C3 FB 0 {Ccol}
R9 Vout N012 {RLED}
C4 N014 N013 {C1}
V5 N021 0 {Rmax}
D4 N003 N004 RB238NS150
R1 N011 0 {Ri}
R2 N011 CS {Rr}
C1 CS 0 100p
R4 N005 Vout {RL2}
SW2 0 N005 N006 0 TOFSW
V1 N006 0 PWL(0 0 15m 0 15.001m 5 17m 5 17.001m 0)
VIOUT N004 Vout 0
X§X2 CS 0 0 FB N010 NC_01 generic_cm_pwm params: gain={gain} pole={pole} Isink={Isink} Isource={Isource} Vlow={VOL} Vhigh={VOH}
X§X3 N002 N009 N003 0 xfmr params: ratio={-N}
X§X1 N012 N013 FB 0 optotof params: Copto={Copto} Rd={Rd} CTR={CTR}
X§X4 0 N014 N013 TL431TOF  ; pins A REF K

* block symbol definitions
.subckt generic_cm_pwm CS FB GNDT CMP DRV DRVB
A7 GNDT N002 GNDT N006 GNDT GNDT QDT GNDT AND Vhigh=5 Vlow=0 Ref=2.5
A8 N004 GNDT GNDT GNDT GNDT N005 N002 GNDT BUF Vhigh=5 Vlow=0 Ref=1.0
A9 N002 GNDT GNDT GNDT GNDT GNDT N006 GNDT BUF Vhigh=5 Vlow=0 Ref=2.5 Td={DT}
A10 GNDT N005 GNDT N008 GNDT GNDT QbDT GNDT AND Vhigh=5 Vlow=0 Ref=2.5
A11 N005 GNDT GNDT GNDT GNDT GNDT N008 GNDT BUF Vhigh=5 Vlow=0 Ref=2.5 Td={DT}
B3 N001 GNDT V=IF(V(QDT,GNDT)>2.5,{VDRV},100m)
B4 N009 GNDT V=IF(V(QbDT,GNDT)>2.5,{VDRV},100m)
R3 DRVB N009 10
C3 DRVB GNDT 10p
R4 DRV N001 10
C4 DRV GNDT 10p
X§X5 N010 FB GNDT CMP op_amp_fan_out params: gain={gain} pole={pole} Isink={Isink} Isource={Isource} Vlow={VOL} Vhigh={VOH}
A12 GNDT N013 N015 N011 GNDT GNDT N007 GNDT OR Vhigh=5 Vlow=0 Ref=2.5
V5 N010 GNDT {Vref}
V8 N003 GNDT PULSE(0 5 0 1n 1n 150n {Tsw})
VmaxDC N015 GNDT PULSE(0 5 {Dutymax*Tsw} 1n 1n {0.01*Tsw} {Tsw})
B1 N012 GNDT V=IF(V(CMP,GNDT)/3>{VCS},{VCS},V(CMP,GNDT)/3)
V1 ramp GNDT PULSE(0 2.5 0 {Tsw-2n} 1n 1n {Tsw})
VSS N014 GNDT PWL(0 100m {TSS} 2.6)
R2 CS N016 19k
B2 N016 GNDT V=IF(V(QDT,GNDT)>2.5,V(ramp,GNDT),0)
X§X2 N012 CS N013 GNDT comptof_g params: VHIGH=5 VLOW=100m VHYS=10m
X§X3 N014 ramp N011 GNDT comptof_g params: VHIGH=5 VLOW=100m VHYS=10m
X§X1 N007 N003 N004 NC_01 GNDT sr_latch_g
.ends generic_cm_pwm

.subckt op_amp_fan_out + - Masse OUT
G1 Masse N004 + - 100µ
R1 N004 Masse {GAIN/100u}
C1 N004 Masse {1/(6.28*(GAIN/100u)*POLE)}
D1 Masse N004 dopamp
E1 N005 Masse N004 Masse 1
D3 N005 N006 dopamp
I1 N006 Masse {ISINK/185}
Q1 Masse N006 N003 0 2N3906
V1 OUT N003 {VLOW-700m}
I2 N002 OUT {Isource}
D4 OUT N002 dopamp
V3 N001 Masse {VHIGH}
D2 N004 N002 dopamp
R2 N002 N001 10
*
.model dopamp D RS=1m VFWD=1m TT=10n Cjo=10p
*
.ends op_amp_fan_out

.subckt comptof_g INV NINV OUT G
B1 HYS NINV V=IF(V(out) > ({VHIGH}+{VLOW})/2,{VHYS},0)
B2 N001 G V=IF(V(HYS,INV)>0,{VHIGH},{VLOW})
R1 N001 OUT 10
C1 OUT G 10p
R2 INV G 1Meg
.ends comptof_g

.subckt sr_latch_g R S Q Qb G
BQ a G V=If((V(R,G)<2.5) & ((V(S,G)>2.5) | (V(Qb,G)<2.5)),5,100m)
R1 R G 1Meg
R2 S G 1Meg
R3 Q a 10
C1 Q G 10p IC=0
BQB b G V=If((V(R,G)>2.5) | ((V(Q,G)<2.5) & (V(S,G)<2.5)),5,100m)
R4 Qb b 10
C2 Qb G 10p IC=5
.ends sr_latch_g

.subckt xfmr 1 2 3 4
B1 1 2 I=I(V1)*{ratio}
B2 N001 4 V=V(1,2)*{ratio}
V1 N001 N002 0
R1 3 N002 1µ
R2 1 2 1Meg
.ends xfmr

.subckt optotof A K C E
F1 N002 E Vf {CTR}
rd N001 A {rd}
Vf N001 K 1.05
V1 C N002 100m
C1 N002 E {Copto}
D1 E N002 Dopto
.model Dopto D tt=100n Rs=10m N=100m
.model DLED D N=1
.ends optotof

.model D D
.lib standard.dio
.model NPN NPN
.model PNP PNP
.lib standard.bjt
*
.model DBUCK D TT=10n Rs=10m Cjo=120p N=0.6 BV=650
.model TOFSW SW (Ron=100m Roff=10Meg Vt=2 Vh=1)
.model DCLP D RS=10 VFWD=1m TT=10n
*
.tran 0 20m 13m 100n uic
;.op
.options abstol=1u vntol=1m reltol=0.01 gmin=100p
+method=gear
* * Run an operating point to obtain the dc labels (.op)
* * These dc labels are the values of the components:
* pV --> pF
* nV --> nF
* kV --> kOhms
* *
* If Ccol is negative, the opto pole is too low
*
.param Vin=120
.param Vout=19
.param Lp=600u
.param Ri=250m
.param N=250m
*
*
.param D={Vout/(Vout+N*Vin)} ; duty ratio calculation
.param mc={0.818/(1-D)} ; recommended compensation value for a Q of 1
.param Sn={(Vin/Lp)*Ri}
.param Sramp={2.5/Tsw} ; 2.5 V over Ts - check your IC specs
.param Se={(mc-1)*Sn}
.param Rr={(Se/Sramp)*19k+1m}
.param fRHPZ={((1-D)**2*Rload/(D*Lp*N**2))/(2*pi)}
.param fcMAX={0.2*fRHPZ} ; maximum crossover frequency
*
*
.param Gfc=-13 ; magnitude at crossover
.param PS=-80 ; phase lag at crossover
*
* Enter Design Goals Information Here *
*
.param fc=2k ; targeted crossover
.param PM=60 ; choose phase margin at crossover
*
* Enter the Values for Vout and Bridge Bias Current *
*
.param Ibias=250u
.param Rlower={Vref/Ibias}
.param Rupper={(Vout-Vref)/Ibias}
*
* Optocoupler specifications *
*
.param Rpullup=20k ; check with the selected control chip
.param Fopto=6k
.param Copto={1/(2*pi*Fopto*Rpullup)}
.param CTR=0.33
.param Rd=100 ; this is the LED dynamic resistance, depends on FB current
*
.param VL=0.2
.param VCEsat=0.3
.param Vdd=5
.param Vf=1
.param A={Vout-Vf-VL}
.param B={Vdd-VCEsat}
.param Rmax={(A/B)*Rpullup*CTR} ; check RLED is below Rmax
*
* Do not edit the below lines *
*
.param boost={PM-PS-90}
.param fp={(tan(boost*pi/180)+sqrt((tan(boost*pi/180))**2+1))*fc}
.param fz={fc**2/fp}
.param G={10**(-Gfc/20)}
.param RLED={CTR*Rpullup/G}
.param C1={1/(2*pi*fz*Rupper)}
.param C2={1/(2*pi*fp*Rpullup)}
.param Ccol={C2-Copto}
*
*
*
.param P=70
.param step=50 ; if step=30, then load is first 70% then goes 100%
.param RL1={Vout**2/(P*(1-step/100))} ; first load
.param RL2={Vout**2/(P*(step/100))} ; final load
.param Rload={Vout**2/P} ; nominal 100% load
*
.param AOL=90
.param GAIN={10**(AOL/20)}
.param pole=30
.param Isink=20m
.param Isource=500u
.param VOL=100m
.param VOH=3
*
.param Vref=2.5
.param Tss=5m
*
*
.param Fsw=65k
.param Tsw={1/Fsw}
.param Dutymax=0.8
.param DT=50n
.param VDRV=12
.param VCS=1
*
.backanno
.end